# EasyEDA Pro project ProPrj_Piano_scan_for_conserts3_2026-02-26.epro, board all
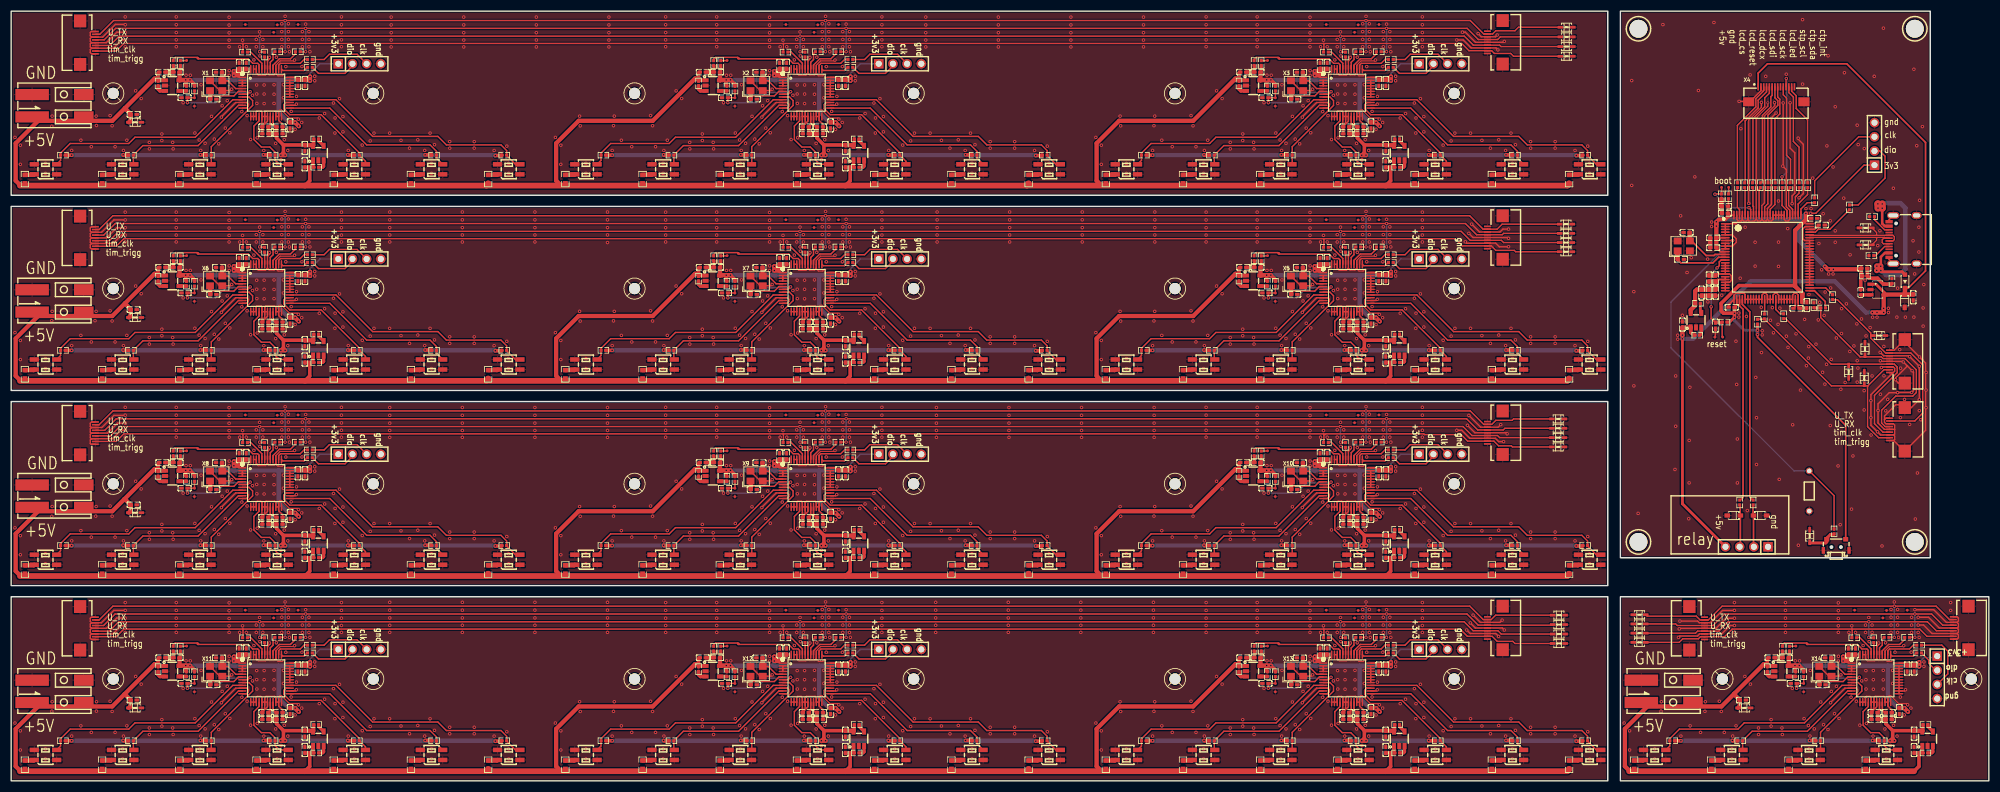
[diagram p6: board, top side]
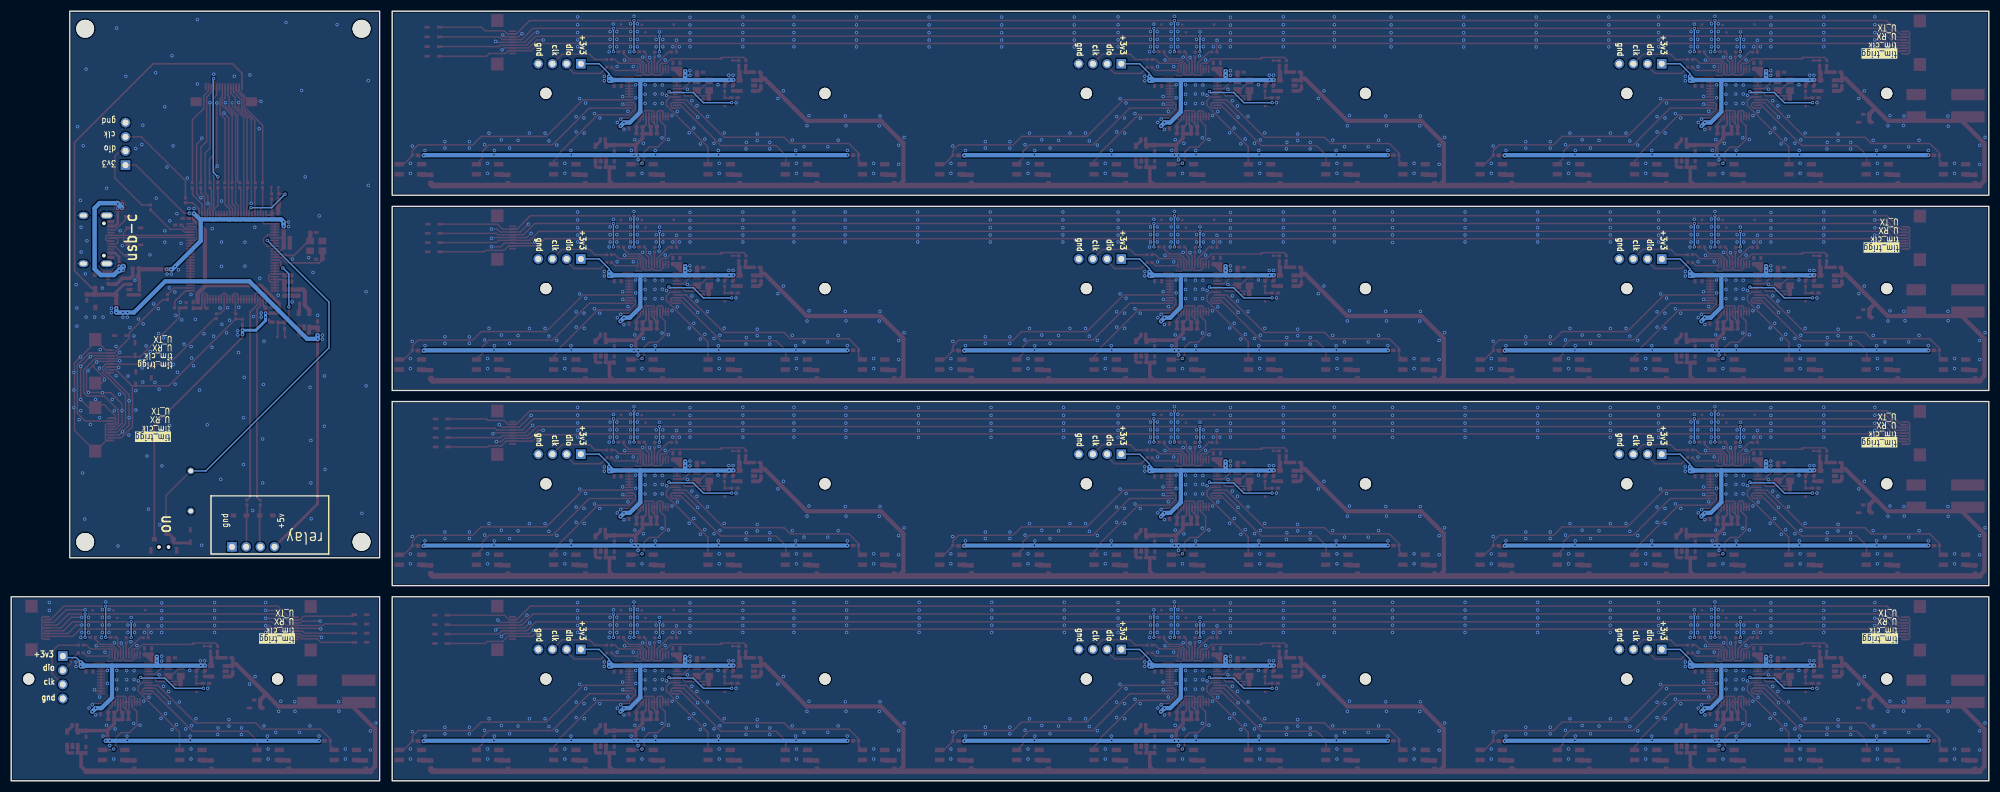
[diagram p7: board, bottom side, seen from below]

Outline 354.25 x 138 mm; copper layers: Top Layer, Bottom Layer. Coordinates in mm from the lower left corner of the outline.
Outline path: rectangle 0,138 286,105 ; rectangle 0,103 286,70 ; rectangle 0,68 286,35 ; rectangle 0,33 286,0 ; rectangle 288.25,33 354.25,0 ; rectangle 343.75,138 288.25,40
Stack: Top Layer 0.035mm / Dielectric1 1.51mm FR4 er 4.5 / Bottom Layer 0.035mm

## Design rules (mm)
net $1N15983: connect
net $1N15973: connect
net $1N15979: connect
net $1N15981: connect
net $1N15995: connect
net $1N15989: connect
net $1N15991: connect
net $1N15993: connect
net $1N16007: connect
net $1N16001: connect
net $1N16003: connect
net $1N16005: connect
net $1N16019: connect
net $1N16013: connect
net $1N16015: connect
net $1N16017: connect
net $1N16029: connect
net $1N16027: connect
net $1N16021: connect
net $1N16031: connect
net $1I21762\TIM_CLK: connect
net $1I21762\U_RX: connect
net $1I21762\TIM_TRIGG: connect
net $1I21762\U_TX: connect
net $1I21762\LCD_CS: connect
net $1I21762\LCD_RESET: connect
net $1I21762\LCD_DCX: connect
net $1I21762\LCD_SDI: connect
net $1I21762\LCD_SCK: connect
net $1I21762\LCD_LED: connect
net $1I21762\CTP_RST: connect
net $1I21762\CTP_SCL: connect
net $1I21762\CTP_SDA: connect
net $1I21762\$1N6680: connect
net $1I21762\CTP_INT: connect
net $1I21762\$1N6676: connect
net $1I21762\$1N6551: connect
net $1I21762\$1N6507: connect
net $1I21762\$1N6457: connect
net $1I21762\$1N6416: connect
net $1I21762\$1N6370: connect
net $1I21762\$1N6331: connect
net $1I21762\$1N6271: connect
net $1I21762\$1N6685: connect
template: Custom Config
spacing copperThickness1oz (default): track to track 0.102, other pairs 0.152 to 0.3
spacing copperThickness2oz: track to track 0.203, other pairs 0.152 to 0.3
track width copperThickness1oz (default): min 0.127, default 0.254, max 2.54
track width copperThickness2oz: min 0.203, default 0.254, max 2.54
track width usb track: min 0.241, default 0.241, max 0.241
differential pair differentialPair (default): width min 0.127, default 0.254, max 2.54; gap min 0.127, default 0.127
via viaSize (default): diameter min 0.5, default 0.61, max 10; hole min 0.3, default 0.305, max 6.3
net $1I21762\USB_DN uses usb track
net $1I21762\USB_DP uses usb track
['net', '$1i21762\\usb dn'] ['NET', 'GND'] uses usb  cooper zone
['net', '$1i21762\\usb dp'] ['NET', 'GND'] uses usb  cooper zone
['net class', 'connect'] ['NET', 'GND'] uses connect zone

## Placement (name value [footprint] x y rotation side)
BOOT1  -  [Test-Point-0.5mm]  31.43 129.17 0 top
BOOT2  -  [Test-Point-0.5mm]  33.45 129.56 0 top
BOOT3  -  [Test-Point-0.5mm]  128.25 129.17 0 top
BOOT4  -  [Test-Point-0.5mm]  130.26 129.56 0 top
BOOT5  -  [Test-Point-0.5mm]  225.06 129.17 0 top
BOOT6  -  [Test-Point-0.5mm]  227.07 129.56 0 top
BOOT7  -  [Test-Point-0.5mm]  225.06 94.17 0 top
BOOT8  -  [Test-Point-0.5mm]  227.07 94.56 0 top
BOOT9  -  [Test-Point-0.5mm]  31.43 94.17 0 top
BOOT10  -  [Test-Point-0.5mm]  33.45 94.56 0 top
BOOT11  -  [Test-Point-0.5mm]  128.25 94.17 0 top
BOOT12  -  [Test-Point-0.5mm]  130.26 94.56 0 top
BOOT13  -  [Test-Point-0.5mm]  31.43 59.17 0 top
BOOT14  -  [Test-Point-0.5mm]  33.45 59.56 0 top
BOOT15  -  [Test-Point-0.5mm]  128.25 59.17 0 top
BOOT16  -  [Test-Point-0.5mm]  130.26 59.56 0 top
BOOT17  -  [Test-Point-0.5mm]  225.06 59.17 0 top
BOOT18  -  [Test-Point-0.5mm]  227.07 59.56 0 top
BOOT19  -  [Test-Point-0.5mm]  31.43 24.16 0 top
BOOT20  -  [Test-Point-0.5mm]  33.45 24.56 0 top
BOOT21  -  [Test-Point-0.5mm]  128.25 24.16 0 top
BOOT22  -  [Test-Point-0.5mm]  130.26 24.56 0 top
BOOT23  -  [Test-Point-0.5mm]  225.06 24.16 0 top
BOOT24  -  [Test-Point-0.5mm]  227.07 24.56 0 top
BOOT25  -  [Test-Point-0.5mm]  319.69 24.16 0 top
BOOT26  -  [Test-Point-0.5mm]  321.71 24.56 0 top
C1  -  [C0402]  36.21 122.23 0 top
C2  -  [C0402]  27.08 127.07 0 top
C3  -  [C0402]  37.23 127.05 0 top
C4  -  [C0402]  40.84 128.19 90 top
C5  -  [C0402]  52.61 110.54 90 top
C6  -  [C0402]  52.61 113.46 270 top
C7  -  [C0402]  31.06 122.48 180 top
C8  -  [C0402]  48.08 116 0 top
C9  -  [C0402]  45.54 117.27 180 top
C10  -  [C0402]  45.54 116 180 top
C11  -  [C0402]  48.08 117.27 0 top
C12  -  [C0402]  49.96 117.52 270 top
C13  -  [C0402]  42.11 128.19 90 top
C14  -  [C0402]  52.63 125.14 270 top
C15  -  [C0402]  51.36 125.14 270 top
C16  -  [C0402]  29.62 127.07 180 top
C17  -  [C0402]  133.02 122.23 0 top
C18  -  [C0402]  123.89 127.07 0 top
C19  -  [C0402]  134.04 127.05 0 top
C20  -  [C0402]  137.65 128.19 90 top
C21  -  [C0402]  149.42 110.54 90 top
C22  -  [C0402]  149.42 113.46 270 top
C23  -  [C0402]  127.87 122.48 180 top
C24  -  [C0402]  144.89 116 0 top
C25  -  [C0402]  142.35 117.27 180 top
C26  -  [C0402]  142.35 116 180 top
C27  -  [C0402]  144.89 117.27 0 top
C28  -  [C0402]  146.77 117.52 270 top
C29  -  [C0402]  138.92 128.19 90 top
C30  -  [C0402]  149.44 125.14 270 top
C31  -  [C0402]  148.17 125.14 270 top
C32  -  [C0402]  126.43 127.07 180 top
C33  -  [C0402]  229.83 122.23 0 top
C34  -  [C0402]  220.7 127.07 0 top
C35  -  [C0402]  230.85 127.05 0 top
C36  -  [C0402]  234.46 128.19 90 top
C37  -  [C0402]  246.23 110.54 90 top
C38  -  [C0402]  246.23 113.46 270 top
C39  -  [C0402]  224.68 122.48 180 top
C40  -  [C0402]  241.7 116 0 top
C41  -  [C0402]  239.16 117.27 180 top
C42  -  [C0402]  239.16 116 180 top
C43  -  [C0402]  241.7 117.27 0 top
C44  -  [C0402]  243.58 117.52 270 top
C45  -  [C0402]  235.73 128.19 90 top
C46  -  [C0402]  246.25 125.14 270 top
C47  -  [C0402]  244.98 125.14 270 top
C48  -  [C0402]  223.24 127.07 180 top
C49  4.7uF  [C0402]  21.95 119.49 180 top
C50  22pF  [C0402]  331.94 91.9 180 top
C51  1uF  [C0402]  299.35 81.81 90 top
C52  1uF  [C0402]  302.78 87.53 270 top
C53  10pF  [C0402]  300.12 98.33 0 top
C54  10pF  [C0402]  299.1 93.5 0 top
C55  100nF  [C0402]  304.89 97.36 0 top
C56  4.7uF  [C0402]  340.71 86.69 90 top
C57  1uF  [C0402]  305.32 87.53 270 top
C58  100nF  [C0402]  304.13 90.07 90 top
C59  1uF  [C0402]  304.13 87.53 270 top
C60  100nF  [C0402]  305.32 90.07 90 top
C61  2.2uF  [C0402]  324.32 99.65 180 top
C62  100nF  [C0402]  305.27 81.61 270 top
C63  2.2uF  [C0402]  319.8 84.74 0 top
C64  100nF  [C0402]  304.89 95.58 180 top
C65  100nF  [C0402]  306.97 101.75 180 top
C66  100nF  [C0402]  308.19 84.91 180 top
C67  100nF  [C0402]  321.66 85.3 270 top
C68  100nF  [C0402]  322.97 100.86 0 top
C69  10uF  [C0402]  306.97 103.02 180 top
C70  -  [C0402]  229.83 87.23 0 top
C71  -  [C0402]  220.7 92.07 0 top
C72  -  [C0402]  230.85 92.05 0 top
C73  -  [C0402]  234.46 93.19 90 top
C74  -  [C0402]  246.23 75.54 90 top
C75  -  [C0402]  246.23 78.46 270 top
C76  -  [C0402]  224.68 87.48 180 top
C77  -  [C0402]  241.7 81 0 top
C78  -  [C0402]  239.16 82.27 180 top
C79  -  [C0402]  239.16 81 180 top
C80  -  [C0402]  241.7 82.27 0 top
C81  -  [C0402]  243.58 82.52 270 top
C82  -  [C0402]  235.73 93.19 90 top
C83  -  [C0402]  246.25 90.14 270 top
C84  -  [C0402]  244.98 90.14 270 top
C85  -  [C0402]  223.24 92.07 180 top
C86  -  [C0402]  36.21 87.23 0 top
C87  -  [C0402]  27.08 92.07 0 top
C88  -  [C0402]  37.23 92.05 0 top
C89  -  [C0402]  40.84 93.19 90 top
C90  -  [C0402]  52.61 75.54 90 top
C91  -  [C0402]  52.61 78.46 270 top
C92  -  [C0402]  31.06 87.48 180 top
C93  -  [C0402]  48.08 81 0 top
C94  -  [C0402]  45.54 82.27 180 top
C95  -  [C0402]  45.54 81 180 top
C96  -  [C0402]  48.08 82.27 0 top
C97  -  [C0402]  49.96 82.52 270 top
C98  -  [C0402]  42.11 93.19 90 top
C99  -  [C0402]  52.63 90.14 270 top
C100  -  [C0402]  51.36 90.14 270 top
C101  -  [C0402]  29.62 92.07 180 top
C102  -  [C0402]  133.02 87.23 0 top
C103  -  [C0402]  123.89 92.07 0 top
C104  -  [C0402]  134.04 92.05 0 top
C105  -  [C0402]  137.65 93.19 90 top
C106  -  [C0402]  149.42 75.54 90 top
C107  -  [C0402]  149.42 78.46 270 top
C108  -  [C0402]  127.87 87.48 180 top
C109  -  [C0402]  144.89 81 0 top
C110  -  [C0402]  142.35 82.27 180 top
C111  -  [C0402]  142.35 81 180 top
C112  -  [C0402]  144.89 82.27 0 top
C113  -  [C0402]  146.77 82.52 270 top
C114  -  [C0402]  138.92 93.19 90 top
C115  -  [C0402]  149.44 90.14 270 top
C116  -  [C0402]  148.17 90.14 270 top
C117  -  [C0402]  126.43 92.07 180 top
C118  4.7uF  [C0402]  21.95 84.49 180 top
C119  -  [C0402]  36.21 52.23 0 top
C120  -  [C0402]  27.08 57.07 0 top
C121  -  [C0402]  37.23 57.05 0 top
C122  -  [C0402]  40.84 58.19 90 top
C123  -  [C0402]  52.61 40.54 90 top
C124  -  [C0402]  52.61 43.46 270 top
C125  -  [C0402]  31.06 52.48 180 top
C126  -  [C0402]  48.08 46 0 top
C127  -  [C0402]  45.54 47.27 180 top
C128  -  [C0402]  45.54 46 180 top
C129  -  [C0402]  48.08 47.27 0 top
C130  -  [C0402]  49.96 47.52 270 top
C131  -  [C0402]  42.11 58.19 90 top
C132  -  [C0402]  52.63 55.14 270 top
C133  -  [C0402]  51.36 55.14 270 top
C134  -  [C0402]  29.62 57.07 180 top
C135  -  [C0402]  133.02 52.23 0 top
C136  -  [C0402]  123.89 57.07 0 top
C137  -  [C0402]  134.04 57.05 0 top
C138  -  [C0402]  137.65 58.19 90 top
C139  -  [C0402]  149.42 40.54 90 top
C140  -  [C0402]  149.42 43.46 270 top
C141  -  [C0402]  127.87 52.48 180 top
C142  -  [C0402]  144.89 46 0 top
C143  -  [C0402]  142.35 47.27 180 top
C144  -  [C0402]  142.35 46 180 top
C145  -  [C0402]  144.89 47.27 0 top
C146  -  [C0402]  146.77 47.52 270 top
C147  -  [C0402]  138.92 58.19 90 top
C148  -  [C0402]  149.44 55.14 270 top
C149  -  [C0402]  148.17 55.14 270 top
C150  -  [C0402]  126.43 57.07 180 top
C151  -  [C0402]  229.83 52.23 0 top
C152  -  [C0402]  220.7 57.07 0 top
C153  -  [C0402]  230.85 57.05 0 top
C154  -  [C0402]  234.46 58.19 90 top
C155  -  [C0402]  246.23 40.54 90 top
C156  -  [C0402]  246.23 43.46 270 top
C157  -  [C0402]  224.68 52.48 180 top
C158  -  [C0402]  241.7 46 0 top
C159  -  [C0402]  239.16 47.27 180 top
C160  -  [C0402]  239.16 46 180 top
C161  -  [C0402]  241.7 47.27 0 top
C162  -  [C0402]  243.58 47.52 270 top
C163  -  [C0402]  235.73 58.19 90 top
C164  -  [C0402]  246.25 55.14 270 top
C165  -  [C0402]  244.98 55.14 270 top
C166  -  [C0402]  223.24 57.07 180 top
C167  4.7uF  [C0402]  21.95 49.49 180 top
C168  -  [C0402]  36.21 17.23 0 top
C169  -  [C0402]  27.08 22.07 0 top
C170  -  [C0402]  37.23 22.05 0 top
C171  -  [C0402]  40.84 23.19 90 top
C172  -  [C0402]  52.61 5.54 90 top
C173  -  [C0402]  52.61 8.46 270 top
C174  -  [C0402]  31.06 17.48 180 top
C175  -  [C0402]  48.08 11 0 top
C176  -  [C0402]  45.54 12.27 180 top
C177  -  [C0402]  45.54 11 180 top
C178  -  [C0402]  48.08 12.27 0 top
C179  -  [C0402]  49.96 12.52 270 top
C180  -  [C0402]  42.11 23.19 90 top
C181  -  [C0402]  52.63 20.14 270 top
C182  -  [C0402]  51.36 20.14 270 top
C183  -  [C0402]  29.62 22.07 180 top
C184  -  [C0402]  133.02 17.23 0 top
C185  -  [C0402]  123.89 22.07 0 top
C186  -  [C0402]  134.04 22.05 0 top
C187  -  [C0402]  137.65 23.19 90 top
C188  -  [C0402]  149.42 5.54 90 top
C189  -  [C0402]  149.42 8.46 270 top
C190  -  [C0402]  127.87 17.48 180 top
C191  -  [C0402]  144.89 11 0 top
C192  -  [C0402]  142.35 12.27 180 top
C193  -  [C0402]  142.35 11 180 top
C194  -  [C0402]  144.89 12.27 0 top
C195  -  [C0402]  146.77 12.52 270 top
C196  -  [C0402]  138.92 23.19 90 top
C197  -  [C0402]  149.44 20.14 270 top
C198  -  [C0402]  148.17 20.14 270 top
C199  -  [C0402]  126.43 22.07 180 top
C200  -  [C0402]  229.83 17.23 0 top
C201  -  [C0402]  220.7 22.07 0 top
C202  -  [C0402]  230.85 22.05 0 top
C203  -  [C0402]  234.46 23.19 90 top
C204  -  [C0402]  246.23 5.54 90 top
C205  -  [C0402]  246.23 8.46 270 top
C206  -  [C0402]  224.68 17.48 180 top
C207  -  [C0402]  241.7 11 0 top
C208  -  [C0402]  239.16 12.27 180 top
C209  -  [C0402]  239.16 11 180 top
C210  -  [C0402]  241.7 12.27 0 top
C211  -  [C0402]  243.58 12.52 270 top
C212  -  [C0402]  235.73 23.19 90 top
C213  -  [C0402]  246.25 20.14 270 top
C214  -  [C0402]  244.98 20.14 270 top
C215  -  [C0402]  223.24 22.07 180 top
C216  4.7uF  [C0402]  21.95 14.49 180 top
C217  -  [C0402]  324.47 17.23 0 top
C218  -  [C0402]  315.34 22.07 0 top
C219  -  [C0402]  325.48 22.05 0 top
C220  -  [C0402]  329.09 23.19 90 top
C221  -  [C0402]  340.86 5.54 90 top
C222  -  [C0402]  340.86 8.46 270 top
C223  -  [C0402]  319.31 17.48 180 top
C224  -  [C0402]  336.33 11 0 top
C225  -  [C0402]  333.79 12.27 180 top
C226  -  [C0402]  333.79 11 180 top
C227  -  [C0402]  336.33 12.27 0 top
C228  -  [C0402]  338.21 12.52 270 top
C229  -  [C0402]  330.36 23.19 90 top
C230  -  [C0402]  340.88 20.14 270 top
C231  -  [C0402]  339.61 20.14 270 top
C232  -  [C0402]  317.88 22.07 180 top
C233  4.7uF  [C0402]  310.2 14.49 180 top
D1  CDSOD323-T05C  [SOD-323_L1.8-W1.3-LS2.5-BI]  22.2 118.08 180 top
D2  CDSOD323-T03C  [SOD-323_L1.8-W1.3-LS2.5-BI]  278.62 135.12 0 top
D3  CDSOD323-T03C  [SOD-323_L1.8-W1.3-LS2.5-BI]  278.62 133.38 0 top
D4  CDSOD323-T03C  [SOD-323_L1.8-W1.3-LS2.5-BI]  278.62 131.65 0 top
D5  CDSOD323-T03C  [SOD-323_L1.8-W1.3-LS2.5-BI]  278.62 129.91 0 top
D6  CDSOD323-T03C  [SOD-323_L1.8-W1.3-LS2.5-BI]  329.15 73.36 270 top
D7  CDSOD323-T03C  [SOD-323_L1.8-W1.3-LS2.5-BI]  332.07 77.42 90 top
D8  CDSOD323-T03C  [SOD-323_L1.8-W1.3-LS2.5-BI]  331.94 72.21 90 top
D9  CDSOD323-T03C  [SOD-323_L1.8-W1.3-LS2.5-BI]  334.61 79.83 0 top
D10  LESD3Z5.0T1G  [SOD-323_L1.8-W1.3-LS2.5-RD]  339.18 86.06 270 top
D11  B5819WS  [SOD-323_L1.7-W1.3-LS2.5-RD]  339.23 89.56 90 top
D12  LESD3Z5.0T1G  [SOD-323_L1.8-W1.3-LS2.5-RD]  313.27 47.58 0 top
D13  LESD3Z5.0T1G  [SOD-323_L1.8-W1.3-LS2.5-RD]  308.57 47.58 180 top
D14  CDSOD323-T05C  [SOD-323_L1.8-W1.3-LS2.5-BI]  332.2 96.09 180 top
D15  CDSOD323-T05C  [SOD-323_L1.8-W1.3-LS2.5-BI]  332.2 99.14 180 top
D16  CDSOD323-T03C  [SOD-323_L1.8-W1.3-LS2.5-BI]  322.16 43.89 270 top
D19  CDSOD323-T05C  [SOD-323_L1.8-W1.3-LS2.5-BI]  22.2 83.08 180 top
D20  CDSOD323-T03C  [SOD-323_L1.8-W1.3-LS2.5-BI]  278.51 99.81 0 top
D21  CDSOD323-T03C  [SOD-323_L1.8-W1.3-LS2.5-BI]  278.51 98.16 0 top
D22  CDSOD323-T03C  [SOD-323_L1.8-W1.3-LS2.5-BI]  278.51 96.51 0 top
D23  CDSOD323-T03C  [SOD-323_L1.8-W1.3-LS2.5-BI]  278.51 94.86 0 top
D24  CDSOD323-T05C  [SOD-323_L1.8-W1.3-LS2.5-BI]  22.2 48.08 180 top
D25  CDSOD323-T03C  [SOD-323_L1.8-W1.3-LS2.5-BI]  277.11 64.89 0 top
D26  CDSOD323-T03C  [SOD-323_L1.8-W1.3-LS2.5-BI]  277.11 63.21 0 top
D27  CDSOD323-T03C  [SOD-323_L1.8-W1.3-LS2.5-BI]  277.11 61.54 0 top
D28  CDSOD323-T03C  [SOD-323_L1.8-W1.3-LS2.5-BI]  277.11 59.87 0 top
D29  CDSOD323-T05C  [SOD-323_L1.8-W1.3-LS2.5-BI]  22.2 13.08 180 top
D30  CDSOD323-T03C  [SOD-323_L1.8-W1.3-LS2.5-BI]  277.24 29.71 0 top
D31  CDSOD323-T03C  [SOD-323_L1.8-W1.3-LS2.5-BI]  277.24 28.02 0 top
D32  CDSOD323-T03C  [SOD-323_L1.8-W1.3-LS2.5-BI]  277.24 26.32 0 top
D33  CDSOD323-T03C  [SOD-323_L1.8-W1.3-LS2.5-BI]  277.24 24.63 0 top
D34  CDSOD323-T05C  [SOD-323_L1.8-W1.3-LS2.5-BI]  310.45 13.08 180 top
D35  CDSOD323-T03C  [SOD-323_L1.8-W1.3-LS2.5-BI]  291.68 29.78 180 top
D36  CDSOD323-T03C  [SOD-323_L1.8-W1.3-LS2.5-BI]  291.68 28.13 180 top
D37  CDSOD323-T03C  [SOD-323_L1.8-W1.3-LS2.5-BI]  291.68 26.48 180 top
D38  CDSOD323-T03C  [SOD-323_L1.8-W1.3-LS2.5-BI]  291.68 24.83 180 top
G1  -  [Test-Point-0.5mm]  41.95 135.6 180 top
G2  -  [Test-Point-0.5mm]  47.02 134.21 180 top
G3  -  [Test-Point-0.5mm]  51.39 135.6 180 top
G4  -  [Test-Point-0.5mm]  47.67 135.55 180 top
G5  -  [Test-Point-0.5mm]  138.76 135.6 180 top
G6  -  [Test-Point-0.5mm]  143.83 134.21 180 top
G7  -  [Test-Point-0.5mm]  148.2 135.6 180 top
G8  -  [Test-Point-0.5mm]  144.48 135.55 180 top
G9  -  [Test-Point-0.5mm]  235.57 135.6 180 top
G10  -  [Test-Point-0.5mm]  240.64 134.21 180 top
G11  -  [Test-Point-0.5mm]  245.01 135.6 180 top
G12  -  [Test-Point-0.5mm]  241.29 135.55 180 top
G13  -  [Test-Point-0.5mm]  235.57 100.6 180 top
G14  -  [Test-Point-0.5mm]  240.64 99.21 180 top
G15  -  [Test-Point-0.5mm]  245.01 100.6 180 top
G16  -  [Test-Point-0.5mm]  241.29 100.55 180 top
G17  -  [Test-Point-0.5mm]  41.95 100.6 180 top
G18  -  [Test-Point-0.5mm]  47.02 99.21 180 top
G19  -  [Test-Point-0.5mm]  51.39 100.6 180 top
G20  -  [Test-Point-0.5mm]  47.67 100.55 180 top
G21  -  [Test-Point-0.5mm]  138.76 100.6 180 top
G22  -  [Test-Point-0.5mm]  143.83 99.21 180 top
G23  -  [Test-Point-0.5mm]  148.2 100.6 180 top
G24  -  [Test-Point-0.5mm]  144.48 100.55 180 top
G25  -  [Test-Point-0.5mm]  41.95 65.6 180 top
G26  -  [Test-Point-0.5mm]  47.02 64.21 180 top
G27  -  [Test-Point-0.5mm]  51.39 65.6 180 top
G28  -  [Test-Point-0.5mm]  47.67 65.55 180 top
G29  -  [Test-Point-0.5mm]  138.76 65.6 180 top
G30  -  [Test-Point-0.5mm]  143.83 64.21 180 top
G31  -  [Test-Point-0.5mm]  148.2 65.6 180 top
G32  -  [Test-Point-0.5mm]  144.48 65.55 180 top
G33  -  [Test-Point-0.5mm]  235.57 65.6 180 top
G34  -  [Test-Point-0.5mm]  240.64 64.21 180 top
G35  -  [Test-Point-0.5mm]  245.01 65.6 180 top
G36  -  [Test-Point-0.5mm]  241.29 65.55 180 top
G37  -  [Test-Point-0.5mm]  41.95 30.6 180 top
G38  -  [Test-Point-0.5mm]  47.02 29.21 180 top
G39  -  [Test-Point-0.5mm]  51.39 30.6 180 top
G40  -  [Test-Point-0.5mm]  47.67 30.55 180 top
G41  -  [Test-Point-0.5mm]  138.76 30.6 180 top
G42  -  [Test-Point-0.5mm]  143.83 29.21 180 top
G43  -  [Test-Point-0.5mm]  148.2 30.6 180 top
G44  -  [Test-Point-0.5mm]  144.48 30.55 180 top
G45  -  [Test-Point-0.5mm]  235.57 30.6 180 top
G46  -  [Test-Point-0.5mm]  240.64 29.21 180 top
G47  -  [Test-Point-0.5mm]  245.01 30.6 180 top
G48  -  [Test-Point-0.5mm]  241.29 30.55 180 top
G49  -  [Test-Point-0.5mm]  330.21 30.6 180 top
G50  -  [Test-Point-0.5mm]  335.27 29.21 180 top
G51  -  [Test-Point-0.5mm]  339.65 30.6 180 top
G52  -  [Test-Point-0.5mm]  335.93 30.55 180 top
H1  d  [HDR-TH_4P-P2.54-V-M]  62.41 128.57 0 top
H2  d  [HDR-TH_4P-P2.54-V-M]  159.22 128.57 0 top
H3  d  [HDR-TH_4P-P2.54-V-M]  256.03 128.57 0 top
H5  debug  [HDR-TH_4P-P2.54-V-M]  333.77 114.2 90 top
H6  relay  [HDR-TH_4P-P2.54-V-M]  310.89 41.96 180 top
H7  d  [HDR-TH_4P-P2.54-V-M]  256.03 93.57 0 top
H8  d  [HDR-TH_4P-P2.54-V-M]  62.41 93.57 0 top
H9  d  [HDR-TH_4P-P2.54-V-M]  159.22 93.57 0 top
H10  d  [HDR-TH_4P-P2.54-V-M]  62.41 58.57 0 top
H11  d  [HDR-TH_4P-P2.54-V-M]  159.22 58.57 0 top
H12  d  [HDR-TH_4P-P2.54-V-M]  256.03 58.57 0 top
H13  d  [HDR-TH_4P-P2.54-V-M]  62.41 23.57 0 top
H14  d  [HDR-TH_4P-P2.54-V-M]  159.22 23.57 0 top
H15  d  [HDR-TH_4P-P2.54-V-M]  256.03 23.57 0 top
H16  d  [HDR-TH_4P-P2.54-V-M]  345.01 18.55 270 top
L1  2.2uH  [IND-SMD_L1.2-W0.7]  331.31 87.58 90 top
R1  -  [R0402]  9.28 112.18 180 top
R2  -  [R0402]  21.46 112.18 0 top
R3  -  [R0402]  35.42 112.18 0 top
R4  -  [R0402]  46.83 112.18 0 top
R5  -  [R0402]  61.93 112.18 0 top
R6  -  [R0402]  75.76 112.18 0 top
R7  -  [R0402]  88.32 112.18 0 top
R8  -  [R0603]  2.46 107.89 90 top
R9  -  [R0603]  16.29 107.89 90 top
R10  -  [R0603]  30.12 107.89 90 top
R11  -  [R0603]  43.95 107.89 90 top
R12  -  [R0603]  57.78 107.89 90 top
R13  -  [R0603]  71.61 107.89 90 top
R14  -  [R0603]  85.44 107.89 90 top
R15  -  [R0402]  26.32 125.04 90 top
R16  -  [R0402]  31.4 124.15 90 top
R17  -  [R0402]  54.65 110.01 180 top
R18  -  [R0402]  54.65 115.09 180 top
R19  62Ω  [R0402]  41.89 130.66 180 top
R20  62Ω  [R0402]  45.39 130.22 90 top
R21  62Ω  [R0402]  47.67 130.73 0 top
R22  62Ω  [R0402]  51.36 130.73 0 top
R23  -  [R0402]  30.3 128.7 90 top
R24  -  [R0402]  32.84 124.13 270 top
R25  -  [R0402]  29.03 128.7 90 top
R27  -  [R0402]  53.52 127.93 0 top
R28  -  [R0402]  53.52 129.33 0 top
R29  -  [R0402]  106.09 112.18 180 top
R30  -  [R0402]  118.27 112.18 0 top
R31  -  [R0402]  132.23 112.18 0 top
R32  -  [R0402]  143.64 112.18 0 top
R33  -  [R0402]  158.74 112.18 0 top
R34  -  [R0402]  172.57 112.18 0 top
R35  -  [R0402]  185.13 112.18 0 top
R36  -  [R0603]  99.27 107.89 90 top
R37  -  [R0603]  113.1 107.89 90 top
R38  -  [R0603]  126.93 107.89 90 top
R39  -  [R0603]  140.76 107.89 90 top
R40  -  [R0603]  154.59 107.89 90 top
R41  -  [R0603]  168.42 107.89 90 top
R42  -  [R0603]  182.25 107.89 90 top
R43  -  [R0402]  123.13 125.04 90 top
R44  -  [R0402]  128.21 124.15 90 top
R45  -  [R0402]  151.46 110.01 180 top
R46  -  [R0402]  151.46 115.09 180 top
R47  62Ω  [R0402]  138.7 130.66 180 top
R48  62Ω  [R0402]  142.2 130.22 90 top
R49  62Ω  [R0402]  144.48 130.73 0 top
R50  62Ω  [R0402]  148.17 130.73 0 top
R51  -  [R0402]  127.11 128.7 90 top
R52  -  [R0402]  129.65 124.13 270 top
R53  -  [R0402]  125.84 128.7 90 top
R55  -  [R0402]  150.33 127.93 0 top
R56  -  [R0402]  150.33 129.33 0 top
R57  -  [R0402]  202.9 112.18 180 top
R58  -  [R0402]  215.08 112.18 0 top
R59  -  [R0402]  229.04 112.18 0 top
R60  -  [R0402]  240.45 112.18 0 top
R61  -  [R0402]  255.55 112.18 0 top
R62  -  [R0402]  269.38 112.18 0 top
R63  -  [R0402]  281.94 112.18 0 top
R64  -  [R0603]  196.08 107.89 90 top
R65  -  [R0603]  209.91 107.89 90 top
R66  -  [R0603]  223.74 107.89 90 top
R67  -  [R0603]  237.57 107.89 90 top
R68  -  [R0603]  251.4 107.89 90 top
R69  -  [R0603]  265.23 107.89 90 top
R70  -  [R0603]  279.06 107.89 90 top
R71  -  [R0402]  219.94 125.04 90 top
R72  -  [R0402]  225.02 124.15 90 top
R73  -  [R0402]  248.27 110.01 180 top
R74  -  [R0402]  248.27 115.09 180 top
R75  62Ω  [R0402]  235.51 130.66 180 top
R76  62Ω  [R0402]  239.01 130.22 90 top
R77  62Ω  [R0402]  241.29 130.73 0 top
R78  62Ω  [R0402]  244.98 130.73 0 top
R79  -  [R0402]  223.92 128.7 90 top
R80  -  [R0402]  226.46 124.13 270 top
R81  -  [R0402]  222.65 128.7 90 top
R83  -  [R0402]  247.14 127.93 0 top
R84  -  [R0402]  247.14 129.33 0 top
R85  680kΩ  [R0402]  332.07 90.5 180 top
R86  150kΩ  [R0402]  336.9 89.61 270 top
R87  10kΩ  [R0402]  302.02 79.91 180 top
R88  100kΩ  [R0402]  302.15 85.62 180 top
R89  62Ω  [R0402]  309.25 106.8 90 top
R90  62Ω  [R0402]  310.51 106.8 90 top
R91  62Ω  [R0402]  311.91 106.8 90 top
R92  62Ω  [R0402]  313.31 106.8 90 top
R93  62Ω  [R0402]  314.71 106.8 90 top
R94  62Ω  [R0402]  315.98 106.8 90 top
R95  33Ω  [R0402]  329.28 102.82 90 top
R96  33Ω  [R0402]  323.05 104.09 90 top
R97  62Ω  [R0402]  317.25 106.8 90 top
R98  62Ω  [R0402]  318.64 106.8 90 top
R99  62Ω  [R0402]  320.29 106.8 90 top
R100  62Ω  [R0402]  321.82 106.8 90 top
R101  330Ω  [R0402]  307.61 104.8 90 top
R102  10kΩ  [R0402]  306.92 82.25 180 top
R103  10kΩ  [R0402]  306.34 104.8 90 top
R104  1kΩ  [R0402]  312.82 82.32 90 top
R105  5.1kΩ  [R0402]  333.21 94.19 0 top
R106  62Ω  [R0402]  314.04 83.26 90 top
R107  62Ω  [R0402]  317.5 83.3 90 top
R108  330Ω  [R0402]  312.04 49.9 90 top
R109  330Ω  [R0402]  309.63 49.9 90 top
R110  62Ω  [R0402]  326.26 86.73 270 top
R111  5.1kΩ  [R0402]  333.34 101.17 0 top
R112  62Ω  [R0402]  324.58 84.79 180 top
R113  1kΩ  [R0402]  322.93 85.3 270 top
R114  330Ω  [R0402]  326.53 44.73 90 top
R115  10kΩ  [RES-TH_BD1.8-L3.2-P7.20-D0.4]  322.09 51.97 90 top
R117  -  [R0402]  202.9 77.18 180 top
R118  -  [R0402]  215.08 77.18 0 top
R119  -  [R0402]  229.04 77.18 0 top
R120  -  [R0402]  240.45 77.18 0 top
R121  -  [R0402]  255.55 77.18 0 top
R122  -  [R0402]  269.38 77.18 0 top
R123  -  [R0402]  281.94 77.18 0 top
R124  -  [R0603]  196.08 72.89 90 top
R125  -  [R0603]  209.91 72.89 90 top
R126  -  [R0603]  223.74 72.89 90 top
R127  -  [R0603]  237.57 72.89 90 top
R128  -  [R0603]  251.4 72.89 90 top
R129  -  [R0603]  265.23 72.89 90 top
R130  -  [R0603]  279.06 72.89 90 top
R131  -  [R0402]  219.94 90.04 90 top
R132  -  [R0402]  225.02 89.15 90 top
R133  -  [R0402]  248.27 75.01 180 top
R134  -  [R0402]  248.27 80.09 180 top
R135  62Ω  [R0402]  235.51 95.66 180 top
R136  62Ω  [R0402]  239.01 95.22 90 top
R137  62Ω  [R0402]  241.29 95.73 0 top
R138  62Ω  [R0402]  244.98 95.73 0 top
R139  -  [R0402]  223.92 93.7 90 top
R140  -  [R0402]  226.46 89.13 270 top
R141  -  [R0402]  222.65 93.7 90 top
R143  -  [R0402]  247.14 92.93 0 top
R144  -  [R0402]  247.14 94.33 0 top
R145  -  [R0402]  9.28 77.18 180 top
R146  -  [R0402]  21.46 77.18 0 top
R147  -  [R0402]  35.42 77.18 0 top
R148  -  [R0402]  46.83 77.18 0 top
R149  -  [R0402]  61.93 77.18 0 top
R150  -  [R0402]  75.76 77.18 0 top
R151  -  [R0402]  88.32 77.18 0 top
R152  -  [R0603]  2.46 72.89 90 top
R153  -  [R0603]  16.29 72.89 90 top
R154  -  [R0603]  30.12 72.89 90 top
R155  -  [R0603]  43.95 72.89 90 top
R156  -  [R0603]  57.78 72.89 90 top
R157  -  [R0603]  71.61 72.89 90 top
R158  -  [R0603]  85.44 72.89 90 top
R159  -  [R0402]  26.32 90.04 90 top
R160  -  [R0402]  31.4 89.15 90 top
R161  -  [R0402]  54.65 75.01 180 top
R162  -  [R0402]  54.65 80.09 180 top
R163  62Ω  [R0402]  41.89 95.66 180 top
R164  62Ω  [R0402]  45.39 95.22 90 top
R165  62Ω  [R0402]  47.67 95.73 0 top
R166  62Ω  [R0402]  51.36 95.73 0 top
R167  -  [R0402]  30.3 93.7 90 top
R168  -  [R0402]  32.84 89.13 270 top
R169  -  [R0402]  29.03 93.7 90 top
R171  -  [R0402]  53.52 92.93 0 top
R172  -  [R0402]  53.52 94.33 0 top
R173  -  [R0402]  106.09 77.18 180 top
R174  -  [R0402]  118.27 77.18 0 top
R175  -  [R0402]  132.23 77.18 0 top
R176  -  [R0402]  143.64 77.18 0 top
R177  -  [R0402]  158.74 77.18 0 top
R178  -  [R0402]  172.57 77.18 0 top
R179  -  [R0402]  185.13 77.18 0 top
R180  -  [R0603]  99.27 72.89 90 top
R181  -  [R0603]  113.1 72.89 90 top
R182  -  [R0603]  126.93 72.89 90 top
R183  -  [R0603]  140.76 72.89 90 top
R184  -  [R0603]  154.59 72.89 90 top
R185  -  [R0603]  168.42 72.89 90 top
R186  -  [R0603]  182.25 72.89 90 top
R187  -  [R0402]  123.13 90.04 90 top
R188  -  [R0402]  128.21 89.15 90 top
R189  -  [R0402]  151.46 75.01 180 top
R190  -  [R0402]  151.46 80.09 180 top
R191  62Ω  [R0402]  138.7 95.66 180 top
R192  62Ω  [R0402]  142.2 95.22 90 top
R193  62Ω  [R0402]  144.48 95.73 0 top
R194  62Ω  [R0402]  148.17 95.73 0 top
R195  -  [R0402]  127.11 93.7 90 top
R196  -  [R0402]  129.65 89.13 270 top
R197  -  [R0402]  125.84 93.7 90 top
R199  -  [R0402]  150.33 92.93 0 top
R200  -  [R0402]  150.33 94.33 0 top
R201  -  [R0402]  9.28 42.18 180 top
R202  -  [R0402]  21.46 42.18 0 top
R203  -  [R0402]  35.42 42.18 0 top
R204  -  [R0402]  46.83 42.18 0 top
R205  -  [R0402]  61.93 42.18 0 top
R206  -  [R0402]  75.76 42.18 0 top
R207  -  [R0402]  88.32 42.18 0 top
R208  -  [R0603]  2.46 37.89 90 top
R209  -  [R0603]  16.29 37.89 90 top
R210  -  [R0603]  30.12 37.89 90 top
R211  -  [R0603]  43.95 37.89 90 top
R212  -  [R0603]  57.78 37.89 90 top
R213  -  [R0603]  71.61 37.89 90 top
R214  -  [R0603]  85.44 37.89 90 top
R215  -  [R0402]  26.32 55.04 90 top
R216  -  [R0402]  31.4 54.15 90 top
R217  -  [R0402]  54.65 40.01 180 top
R218  -  [R0402]  54.65 45.09 180 top
R219  62Ω  [R0402]  41.89 60.66 180 top
R220  62Ω  [R0402]  45.39 60.22 90 top
R221  62Ω  [R0402]  47.67 60.73 0 top
R222  62Ω  [R0402]  51.36 60.73 0 top
R223  -  [R0402]  30.3 58.7 90 top
R224  -  [R0402]  32.84 54.13 270 top
R225  -  [R0402]  29.03 58.7 90 top
R227  -  [R0402]  53.52 57.93 0 top
R228  -  [R0402]  53.52 59.33 0 top
R229  -  [R0402]  106.09 42.18 180 top
R230  -  [R0402]  118.27 42.18 0 top
R231  -  [R0402]  132.23 42.18 0 top
R232  -  [R0402]  143.64 42.18 0 top
R233  -  [R0402]  158.74 42.18 0 top
R234  -  [R0402]  172.57 42.18 0 top
R235  -  [R0402]  185.13 42.18 0 top
R236  -  [R0603]  99.27 37.89 90 top
R237  -  [R0603]  113.1 37.89 90 top
R238  -  [R0603]  126.93 37.89 90 top
R239  -  [R0603]  140.76 37.89 90 top
R240  -  [R0603]  154.59 37.89 90 top
R241  -  [R0603]  168.42 37.89 90 top
R242  -  [R0603]  182.25 37.89 90 top
R243  -  [R0402]  123.13 55.04 90 top
R244  -  [R0402]  128.21 54.15 90 top
R245  -  [R0402]  151.46 40.01 180 top
R246  -  [R0402]  151.46 45.09 180 top
R247  62Ω  [R0402]  138.7 60.66 180 top
R248  62Ω  [R0402]  142.2 60.22 90 top
R249  62Ω  [R0402]  144.48 60.73 0 top
R250  62Ω  [R0402]  148.17 60.73 0 top
R251  -  [R0402]  127.11 58.7 90 top
R252  -  [R0402]  129.65 54.13 270 top
R253  -  [R0402]  125.84 58.7 90 top
R255  -  [R0402]  150.33 57.93 0 top
R256  -  [R0402]  150.33 59.33 0 top
R257  -  [R0402]  202.9 42.18 180 top
R258  -  [R0402]  215.08 42.18 0 top
R259  -  [R0402]  229.04 42.18 0 top
R260  -  [R0402]  240.45 42.18 0 top
R261  -  [R0402]  255.55 42.18 0 top
R262  -  [R0402]  269.38 42.18 0 top
R263  -  [R0402]  281.94 42.18 0 top
R264  -  [R0603]  196.08 37.89 90 top
R265  -  [R0603]  209.91 37.89 90 top
R266  -  [R0603]  223.74 37.89 90 top
R267  -  [R0603]  237.57 37.89 90 top
R268  -  [R0603]  251.4 37.89 90 top
R269  -  [R0603]  265.23 37.89 90 top
R270  -  [R0603]  279.06 37.89 90 top
R271  -  [R0402]  219.94 55.04 90 top
R272  -  [R0402]  225.02 54.15 90 top
R273  -  [R0402]  248.27 40.01 180 top
R274  -  [R0402]  248.27 45.09 180 top
R275  62Ω  [R0402]  235.51 60.66 180 top
R276  62Ω  [R0402]  239.01 60.22 90 top
R277  62Ω  [R0402]  241.29 60.73 0 top
R278  62Ω  [R0402]  244.98 60.73 0 top
R279  -  [R0402]  223.92 58.7 90 top
R280  -  [R0402]  226.46 54.13 270 top
R281  -  [R0402]  222.65 58.7 90 top
R283  -  [R0402]  247.14 57.93 0 top
R284  -  [R0402]  247.14 59.33 0 top
R285  -  [R0402]  9.28 7.18 180 top
R286  -  [R0402]  21.46 7.18 0 top
R287  -  [R0402]  35.42 7.18 0 top
R288  -  [R0402]  46.83 7.18 0 top
R289  -  [R0402]  61.93 7.18 0 top
R290  -  [R0402]  75.76 7.18 0 top
R291  -  [R0402]  88.32 7.18 0 top
R292  -  [R0603]  2.46 2.89 90 top
R293  -  [R0603]  16.29 2.89 90 top
R294  -  [R0603]  30.12 2.89 90 top
R295  -  [R0603]  43.95 2.89 90 top
R296  -  [R0603]  57.78 2.89 90 top
R297  -  [R0603]  71.61 2.89 90 top
R298  -  [R0603]  85.44 2.89 90 top
R299  -  [R0402]  26.32 20.04 90 top
R300  -  [R0402]  31.4 19.15 90 top
R301  -  [R0402]  54.65 5.01 180 top
R302  -  [R0402]  54.65 10.09 180 top
R303  62Ω  [R0402]  41.89 25.66 180 top
R304  62Ω  [R0402]  45.39 25.22 90 top
R305  62Ω  [R0402]  47.67 25.73 0 top
R306  62Ω  [R0402]  51.36 25.73 0 top
R307  -  [R0402]  30.3 23.7 90 top
R308  -  [R0402]  32.84 19.13 270 top
R309  -  [R0402]  29.03 23.7 90 top
R311  -  [R0402]  53.52 22.93 0 top
R312  -  [R0402]  53.52 24.33 0 top
R313  -  [R0402]  106.09 7.18 180 top
R314  -  [R0402]  118.27 7.18 0 top
R315  -  [R0402]  132.23 7.18 0 top
R316  -  [R0402]  143.64 7.18 0 top
R317  -  [R0402]  158.74 7.18 0 top
R318  -  [R0402]  172.57 7.18 0 top
R319  -  [R0402]  185.13 7.18 0 top
R320  -  [R0603]  99.27 2.89 90 top
R321  -  [R0603]  113.1 2.89 90 top
R322  -  [R0603]  126.93 2.89 90 top
R323  -  [R0603]  140.76 2.89 90 top
R324  -  [R0603]  154.59 2.89 90 top
R325  -  [R0603]  168.42 2.89 90 top
R326  -  [R0603]  182.25 2.89 90 top
R327  -  [R0402]  123.13 20.04 90 top
R328  -  [R0402]  128.21 19.15 90 top
R329  -  [R0402]  151.46 5.01 180 top
R330  -  [R0402]  151.46 10.09 180 top
R331  62Ω  [R0402]  138.7 25.66 180 top
R332  62Ω  [R0402]  142.2 25.22 90 top
R333  62Ω  [R0402]  144.48 25.73 0 top
R334  62Ω  [R0402]  148.17 25.73 0 top
R335  -  [R0402]  127.11 23.7 90 top
R336  -  [R0402]  129.65 19.13 270 top
R337  -  [R0402]  125.84 23.7 90 top
R339  -  [R0402]  150.33 22.93 0 top
R340  -  [R0402]  150.33 24.33 0 top
R341  -  [R0402]  202.9 7.18 180 top
R342  -  [R0402]  215.08 7.18 0 top
R343  -  [R0402]  229.04 7.18 0 top
R344  -  [R0402]  240.45 7.18 0 top
R345  -  [R0402]  255.55 7.18 0 top
R346  -  [R0402]  269.38 7.18 0 top
R347  -  [R0402]  281.94 7.18 0 top
R348  -  [R0603]  196.08 2.89 90 top
R349  -  [R0603]  209.91 2.89 90 top
R350  -  [R0603]  223.74 2.89 90 top
R351  -  [R0603]  237.57 2.89 90 top
R352  -  [R0603]  251.4 2.89 90 top
R353  -  [R0603]  265.23 2.89 90 top
R354  -  [R0603]  279.06 2.89 90 top
R355  -  [R0402]  219.94 20.04 90 top
R356  -  [R0402]  225.02 19.15 90 top
R357  -  [R0402]  248.27 5.01 180 top
R358  -  [R0402]  248.27 10.09 180 top
R359  62Ω  [R0402]  235.51 25.66 180 top
R360  62Ω  [R0402]  239.01 25.22 90 top
R361  62Ω  [R0402]  241.29 25.73 0 top
R362  62Ω  [R0402]  244.98 25.73 0 top
R363  -  [R0402]  223.92 23.7 90 top
R364  -  [R0402]  226.46 19.13 270 top
R365  -  [R0402]  222.65 23.7 90 top
R367  -  [R0402]  247.14 22.93 0 top
R368  -  [R0402]  247.14 24.33 0 top
R369  -  [R0402]  297.53 7.18 180 top
R370  -  [R0402]  309.71 7.18 0 top
R371  -  [R0402]  323.67 7.18 0 top
R372  -  [R0402]  335.09 7.18 0 top
R376  -  [R0603]  290.72 2.89 90 top
R377  -  [R0603]  304.55 2.89 90 top
R378  -  [R0603]  318.38 2.89 90 top
R379  -  [R0603]  332.21 2.89 90 top
R383  -  [R0402]  314.57 20.04 90 top
R384  -  [R0402]  319.65 19.15 90 top
R385  -  [R0402]  342.9 5.01 180 top
R386  -  [R0402]  342.9 10.09 180 top
R387  62Ω  [R0402]  330.14 25.66 180 top
R388  62Ω  [R0402]  333.64 25.22 90 top
R389  62Ω  [R0402]  335.93 25.73 0 top
R390  62Ω  [R0402]  339.61 25.73 0 top
R391  -  [R0402]  318.55 23.7 90 top
R392  -  [R0402]  321.09 19.13 270 top
R393  -  [R0402]  317.28 23.7 90 top
R395  -  [R0402]  341.77 22.93 0 top
R396  -  [R0402]  341.77 24.33 0 top
RESET1  -  [Test-Point-0.5mm]  32.83 120.97 0 top
RESET2  -  [Test-Point-0.5mm]  129.64 120.97 0 top
RESET3  -  [Test-Point-0.5mm]  226.45 120.97 0 top
RESET4  -  [Test-Point-0.5mm]  226.45 85.97 0 top
RESET5  -  [Test-Point-0.5mm]  32.83 85.97 0 top
RESET6  -  [Test-Point-0.5mm]  129.64 85.97 0 top
RESET7  -  [Test-Point-0.5mm]  32.83 50.97 0 top
RESET8  -  [Test-Point-0.5mm]  129.64 50.97 0 top
RESET9  -  [Test-Point-0.5mm]  226.45 50.97 0 top
RESET10  -  [Test-Point-0.5mm]  32.83 15.97 0 top
RESET11  -  [Test-Point-0.5mm]  129.64 15.97 0 top
RESET12  -  [Test-Point-0.5mm]  226.45 15.97 0 top
RESET13  -  [Test-Point-0.5mm]  321.08 15.97 0 top
RESSET1  -  [Test-Point-0.5mm]  32.84 122.45 0 top
RESSET2  -  [Test-Point-0.5mm]  129.65 122.45 0 top
RESSET3  -  [Test-Point-0.5mm]  226.46 122.45 0 top
RESSET4  -  [Test-Point-0.5mm]  226.46 87.45 0 top
RESSET5  -  [Test-Point-0.5mm]  32.84 87.45 0 top
RESSET6  -  [Test-Point-0.5mm]  129.65 87.45 0 top
RESSET7  -  [Test-Point-0.5mm]  32.84 52.45 0 top
RESSET8  -  [Test-Point-0.5mm]  129.65 52.45 0 top
RESSET9  -  [Test-Point-0.5mm]  226.46 52.45 0 top
RESSET10  -  [Test-Point-0.5mm]  32.84 17.45 0 top
RESSET11  -  [Test-Point-0.5mm]  129.65 17.45 0 top
RESSET12  -  [Test-Point-0.5mm]  226.46 17.45 0 top
RESSET13  -  [Test-Point-0.5mm]  321.09 17.45 0 top
SCREW1  -  [Screw-Hole-M2]  64.85 123.26 0 top
SCREW2  -  [Screw-Hole-M2]  18.28 123.26 0 top
SCREW3  -  [Screw-Hole-M2]  161.66 123.26 0 top
SCREW4  -  [Screw-Hole-M2]  111.66 123.26 0 top
SCREW5  -  [Screw-Hole-M2]  258.47 123.26 0 top
SCREW6  -  [Screw-Hole-M2]  208.47 123.26 0 top
SCREW7  -  [Screw-Hole-M3]  340.93 42.78 270 top
SCREW8  -  [Screw-Hole-M3]  291.43 134.78 270 top
SCREW9  -  [Screw-Hole-M3]  291.43 42.78 270 top
SCREW10  -  [Screw-Hole-M3]  340.93 134.78 270 top
SCREW11  -  [Screw-Hole-M2]  258.47 88.26 0 top
SCREW12  -  [Screw-Hole-M2]  208.47 88.26 0 top
SCREW13  -  [Screw-Hole-M2]  64.85 88.26 0 top
SCREW14  -  [Screw-Hole-M2]  18.28 88.26 0 top
SCREW15  -  [Screw-Hole-M2]  161.66 88.26 0 top
SCREW16  -  [Screw-Hole-M2]  111.66 88.26 0 top
SCREW17  -  [Screw-Hole-M2]  64.85 53.26 0 top
SCREW18  -  [Screw-Hole-M2]  18.28 53.26 0 top
SCREW19  -  [Screw-Hole-M2]  161.66 53.26 0 top
SCREW20  -  [Screw-Hole-M2]  111.66 53.26 0 top
SCREW21  -  [Screw-Hole-M2]  258.47 53.26 0 top
SCREW22  -  [Screw-Hole-M2]  208.47 53.26 0 top
SCREW23  -  [Screw-Hole-M2]  64.85 18.26 0 top
SCREW24  -  [Screw-Hole-M2]  18.28 18.26 0 top
SCREW25  -  [Screw-Hole-M2]  161.66 18.26 0 top
SCREW26  -  [Screw-Hole-M2]  111.66 18.26 0 top
SCREW27  -  [Screw-Hole-M2]  258.47 18.26 0 top
SCREW28  -  [Screw-Hole-M2]  208.47 18.26 0 top
SCREW29  -  [Screw-Hole-M2]  351.11 18.26 0 top
SCREW30  -  [Screw-Hole-M2]  306.54 18.26 0 top
SW1  1TS003BBB-2000-3503B-CT  [KEY-SMD_1TS003B]  326.91 42.32 0 top
TP1  -  [Test-Point-0.5mm]  307.65 106.41 90 top
TP2  -  [Test-Point-0.5mm]  306.58 79.56 0 top
TP3  -  [Test-Point-0.5mm]  306.38 106.41 90 top
TP4  -  [Test-Point-0.5mm]  305.19 79.56 0 top
U1  q  [OPTO-SMD_QRE1113GR]  6.15 109.64 0 top
U2  q  [OPTO-SMD_QRE1113GR]  19.98 109.64 0 top
U3  q  [OPTO-SMD_QRE1113GR]  33.81 109.64 0 top
U4  q  [OPTO-SMD_QRE1113GR]  47.64 109.64 0 top
U5  q  [OPTO-SMD_QRE1113GR]  61.47 109.64 0 top
U6  q  [OPTO-SMD_QRE1113GR]  75.3 109.64 0 top
U7  q  [OPTO-SMD_QRE1113GR]  89.13 109.64 0 top
U8  p1  [TSOT-23-5_L2.9-W1.6-P0.95-LS2.8-BR]  28.86 124.66 180 top
U9  p2  [TSOT-23-5_L2.9-W1.6-P0.95-LS2.8-BR]  55.03 112.55 270 top
U10  STM32G474CBT6  [LQFP-48_L7.0-W7.0-P0.50-LS9.0-BL]  45.66 123.37 270 top
U11  q  [OPTO-SMD_QRE1113GR]  102.96 109.64 0 top
U12  q  [OPTO-SMD_QRE1113GR]  116.79 109.64 0 top
U13  q  [OPTO-SMD_QRE1113GR]  130.62 109.64 0 top
U14  q  [OPTO-SMD_QRE1113GR]  144.45 109.64 0 top
U15  q  [OPTO-SMD_QRE1113GR]  158.28 109.64 0 top
U16  q  [OPTO-SMD_QRE1113GR]  172.11 109.64 0 top
U17  q  [OPTO-SMD_QRE1113GR]  185.94 109.64 0 top
U18  p1  [TSOT-23-5_L2.9-W1.6-P0.95-LS2.8-BR]  125.67 124.66 180 top
U19  p2  [TSOT-23-5_L2.9-W1.6-P0.95-LS2.8-BR]  151.84 112.55 270 top
U20  STM32G474CBT6  [LQFP-48_L7.0-W7.0-P0.50-LS9.0-BL]  142.47 123.37 270 top
U21  q  [OPTO-SMD_QRE1113GR]  199.77 109.64 0 top
U22  q  [OPTO-SMD_QRE1113GR]  213.6 109.64 0 top
U23  q  [OPTO-SMD_QRE1113GR]  227.43 109.64 0 top
U24  q  [OPTO-SMD_QRE1113GR]  241.26 109.64 0 top
U25  q  [OPTO-SMD_QRE1113GR]  255.09 109.64 0 top
U26  q  [OPTO-SMD_QRE1113GR]  268.92 109.64 0 top
U27  q  [OPTO-SMD_QRE1113GR]  282.75 109.64 0 top
U28  p1  [TSOT-23-5_L2.9-W1.6-P0.95-LS2.8-BR]  222.48 124.66 180 top
U29  p2  [TSOT-23-5_L2.9-W1.6-P0.95-LS2.8-BR]  248.65 112.55 270 top
U30  STM32G474CBT6  [LQFP-48_L7.0-W7.0-P0.50-LS9.0-BL]  239.28 123.37 270 top
U31  AFD01-S09FCA-00  [FPC-SMD_9P-P0.50_JS_AFD01-S09FCA-00]  13.72 132.35 90 top
U32  AFD01-S09FCA-00  [FPC-SMD_9P-P0.50_JS_AFD01-S09FCA-00]  265.81 132.41 270 top
U33  2060-452/998-404  [CONN-SMD_2060-452]  8.38 121.05 0 top
U35  AFD01-S09FCA-00  [FPC-SMD_9P-P0.50_JS_AFD01-S09FCA-00]  337.84 75.21 270 top
U36  AFD01-S09FCA-00  [FPC-SMD_9P-P0.50_JS_AFD01-S09FCA-00]  337.84 63.02 270 top
U37  SY8088AAC  [SOT-23-5_L3.0-W1.7-P0.95-LS2.8-BR]  334.36 88.09 180 top
U38  LDLN030G33R  [TSOT-23-5_L2.9-W1.6-P0.95-LS2.8-BR]  301.8 82.59 270 top
U39  STM32H723VGT6  [LQFP-100_L14.0-W14.0-P0.50-LS16.0-BL]  314.59 93.88 270 top
U40  25MHz  [CRYSTAL-SMD_4P-L3.2-W2.5-BL-1]  299.61 95.91 0 top
U42  q  [OPTO-SMD_QRE1113GR]  199.77 74.64 0 top
U43  q  [OPTO-SMD_QRE1113GR]  213.6 74.64 0 top
U44  q  [OPTO-SMD_QRE1113GR]  227.43 74.64 0 top
U45  q  [OPTO-SMD_QRE1113GR]  241.26 74.64 0 top
U46  q  [OPTO-SMD_QRE1113GR]  255.09 74.64 0 top
U47  q  [OPTO-SMD_QRE1113GR]  268.92 74.64 0 top
U48  q  [OPTO-SMD_QRE1113GR]  282.75 74.64 0 top
U49  p1  [TSOT-23-5_L2.9-W1.6-P0.95-LS2.8-BR]  222.48 89.66 180 top
U50  p2  [TSOT-23-5_L2.9-W1.6-P0.95-LS2.8-BR]  248.65 77.55 270 top
U51  STM32G474CBT6  [LQFP-48_L7.0-W7.0-P0.50-LS9.0-BL]  239.28 88.37 270 top
U52  q  [OPTO-SMD_QRE1113GR]  6.15 74.64 0 top
U53  q  [OPTO-SMD_QRE1113GR]  19.98 74.64 0 top
U54  q  [OPTO-SMD_QRE1113GR]  33.81 74.64 0 top
U55  q  [OPTO-SMD_QRE1113GR]  47.64 74.64 0 top
U56  q  [OPTO-SMD_QRE1113GR]  61.47 74.64 0 top
U57  q  [OPTO-SMD_QRE1113GR]  75.3 74.64 0 top
U58  q  [OPTO-SMD_QRE1113GR]  89.13 74.64 0 top
U59  p1  [TSOT-23-5_L2.9-W1.6-P0.95-LS2.8-BR]  28.86 89.66 180 top
U60  p2  [TSOT-23-5_L2.9-W1.6-P0.95-LS2.8-BR]  55.03 77.55 270 top
U61  STM32G474CBT6  [LQFP-48_L7.0-W7.0-P0.50-LS9.0-BL]  45.66 88.37 270 top
U62  q  [OPTO-SMD_QRE1113GR]  102.96 74.64 0 top
U63  q  [OPTO-SMD_QRE1113GR]  116.79 74.64 0 top
U64  q  [OPTO-SMD_QRE1113GR]  130.62 74.64 0 top
U65  q  [OPTO-SMD_QRE1113GR]  144.45 74.64 0 top
U66  q  [OPTO-SMD_QRE1113GR]  158.28 74.64 0 top
U67  q  [OPTO-SMD_QRE1113GR]  172.11 74.64 0 top
U68  q  [OPTO-SMD_QRE1113GR]  185.94 74.64 0 top
U69  p1  [TSOT-23-5_L2.9-W1.6-P0.95-LS2.8-BR]  125.67 89.66 180 top
U70  p2  [TSOT-23-5_L2.9-W1.6-P0.95-LS2.8-BR]  151.84 77.55 270 top
U71  STM32G474CBT6  [LQFP-48_L7.0-W7.0-P0.50-LS9.0-BL]  142.47 88.37 270 top
U72  AFD01-S09FCA-00  [FPC-SMD_9P-P0.50_JS_AFD01-S09FCA-00]  13.72 97.35 90 top
U73  AFD01-S09FCA-00  [FPC-SMD_9P-P0.50_JS_AFD01-S09FCA-00]  265.81 97.41 270 top
U74  2060-452/998-404  [CONN-SMD_2060-452]  8.38 86.05 0 top
U76  q  [OPTO-SMD_QRE1113GR]  6.15 39.64 0 top
U77  q  [OPTO-SMD_QRE1113GR]  19.98 39.64 0 top
U78  q  [OPTO-SMD_QRE1113GR]  33.81 39.64 0 top
U79  q  [OPTO-SMD_QRE1113GR]  47.64 39.64 0 top
U80  q  [OPTO-SMD_QRE1113GR]  61.47 39.64 0 top
U81  q  [OPTO-SMD_QRE1113GR]  75.3 39.64 0 top
U82  q  [OPTO-SMD_QRE1113GR]  89.13 39.64 0 top
U83  p1  [TSOT-23-5_L2.9-W1.6-P0.95-LS2.8-BR]  28.86 54.66 180 top
U84  p2  [TSOT-23-5_L2.9-W1.6-P0.95-LS2.8-BR]  55.03 42.55 270 top
U85  STM32G474CBT6  [LQFP-48_L7.0-W7.0-P0.50-LS9.0-BL]  45.66 53.37 270 top
U86  q  [OPTO-SMD_QRE1113GR]  102.96 39.64 0 top
U87  q  [OPTO-SMD_QRE1113GR]  116.79 39.64 0 top
U88  q  [OPTO-SMD_QRE1113GR]  130.62 39.64 0 top
U89  q  [OPTO-SMD_QRE1113GR]  144.45 39.64 0 top
U90  q  [OPTO-SMD_QRE1113GR]  158.28 39.64 0 top
U91  q  [OPTO-SMD_QRE1113GR]  172.11 39.64 0 top
U92  q  [OPTO-SMD_QRE1113GR]  185.94 39.64 0 top
U93  p1  [TSOT-23-5_L2.9-W1.6-P0.95-LS2.8-BR]  125.67 54.66 180 top
U94  p2  [TSOT-23-5_L2.9-W1.6-P0.95-LS2.8-BR]  151.84 42.55 270 top
U95  STM32G474CBT6  [LQFP-48_L7.0-W7.0-P0.50-LS9.0-BL]  142.47 53.37 270 top
U96  q  [OPTO-SMD_QRE1113GR]  199.77 39.64 0 top
U97  q  [OPTO-SMD_QRE1113GR]  213.6 39.64 0 top
U98  q  [OPTO-SMD_QRE1113GR]  227.43 39.64 0 top
U99  q  [OPTO-SMD_QRE1113GR]  241.26 39.64 0 top
U100  q  [OPTO-SMD_QRE1113GR]  255.09 39.64 0 top
U101  q  [OPTO-SMD_QRE1113GR]  268.92 39.64 0 top
U102  q  [OPTO-SMD_QRE1113GR]  282.75 39.64 0 top
U103  p1  [TSOT-23-5_L2.9-W1.6-P0.95-LS2.8-BR]  222.48 54.66 180 top
U104  p2  [TSOT-23-5_L2.9-W1.6-P0.95-LS2.8-BR]  248.65 42.55 270 top
U105  STM32G474CBT6  [LQFP-48_L7.0-W7.0-P0.50-LS9.0-BL]  239.28 53.37 270 top
U106  AFD01-S09FCA-00  [FPC-SMD_9P-P0.50_JS_AFD01-S09FCA-00]  13.72 62.35 90 top
U107  AFD01-S09FCA-00  [FPC-SMD_9P-P0.50_JS_AFD01-S09FCA-00]  265.81 62.41 270 top
U108  2060-452/998-404  [CONN-SMD_2060-452]  8.38 51.05 0 top
U110  q  [OPTO-SMD_QRE1113GR]  6.15 4.64 0 top
U111  q  [OPTO-SMD_QRE1113GR]  19.98 4.64 0 top
U112  q  [OPTO-SMD_QRE1113GR]  33.81 4.64 0 top
U113  q  [OPTO-SMD_QRE1113GR]  47.64 4.64 0 top
U114  q  [OPTO-SMD_QRE1113GR]  61.47 4.64 0 top
U115  q  [OPTO-SMD_QRE1113GR]  75.3 4.64 0 top
U116  q  [OPTO-SMD_QRE1113GR]  89.13 4.64 0 top
U117  p1  [TSOT-23-5_L2.9-W1.6-P0.95-LS2.8-BR]  28.86 19.66 180 top
U118  p2  [TSOT-23-5_L2.9-W1.6-P0.95-LS2.8-BR]  55.03 7.55 270 top
U119  STM32G474CBT6  [LQFP-48_L7.0-W7.0-P0.50-LS9.0-BL]  45.66 18.37 270 top
U120  q  [OPTO-SMD_QRE1113GR]  102.96 4.64 0 top
U121  q  [OPTO-SMD_QRE1113GR]  116.79 4.64 0 top
U122  q  [OPTO-SMD_QRE1113GR]  130.62 4.64 0 top
U123  q  [OPTO-SMD_QRE1113GR]  144.45 4.64 0 top
U124  q  [OPTO-SMD_QRE1113GR]  158.28 4.64 0 top
U125  q  [OPTO-SMD_QRE1113GR]  172.11 4.64 0 top
U126  q  [OPTO-SMD_QRE1113GR]  185.94 4.64 0 top
U127  p1  [TSOT-23-5_L2.9-W1.6-P0.95-LS2.8-BR]  125.67 19.66 180 top
U128  p2  [TSOT-23-5_L2.9-W1.6-P0.95-LS2.8-BR]  151.84 7.55 270 top
U129  STM32G474CBT6  [LQFP-48_L7.0-W7.0-P0.50-LS9.0-BL]  142.47 18.37 270 top
U130  q  [OPTO-SMD_QRE1113GR]  199.77 4.64 0 top
U131  q  [OPTO-SMD_QRE1113GR]  213.6 4.64 0 top
U132  q  [OPTO-SMD_QRE1113GR]  227.43 4.64 0 top
U133  q  [OPTO-SMD_QRE1113GR]  241.26 4.64 0 top
U134  q  [OPTO-SMD_QRE1113GR]  255.09 4.64 0 top
U135  q  [OPTO-SMD_QRE1113GR]  268.92 4.64 0 top
U136  q  [OPTO-SMD_QRE1113GR]  282.75 4.64 0 top
U137  p1  [TSOT-23-5_L2.9-W1.6-P0.95-LS2.8-BR]  222.48 19.66 180 top
U138  p2  [TSOT-23-5_L2.9-W1.6-P0.95-LS2.8-BR]  248.65 7.55 270 top
U139  STM32G474CBT6  [LQFP-48_L7.0-W7.0-P0.50-LS9.0-BL]  239.28 18.37 270 top
U140  AFD01-S09FCA-00  [FPC-SMD_9P-P0.50_JS_AFD01-S09FCA-00]  13.72 27.35 90 top
U141  AFD01-S09FCA-00  [FPC-SMD_9P-P0.50_JS_AFD01-S09FCA-00]  265.81 27.41 270 top
U142  2060-452/998-404  [CONN-SMD_2060-452]  8.38 16.05 0 top
U144  q  [OPTO-SMD_QRE1113GR]  294.4 4.64 0 top
U145  q  [OPTO-SMD_QRE1113GR]  308.23 4.64 0 top
U146  q  [OPTO-SMD_QRE1113GR]  322.06 4.64 0 top
U147  q  [OPTO-SMD_QRE1113GR]  335.89 4.64 0 top
U151  p1  [TSOT-23-5_L2.9-W1.6-P0.95-LS2.8-BR]  317.11 19.66 180 top
U152  p2  [TSOT-23-5_L2.9-W1.6-P0.95-LS2.8-BR]  343.28 7.55 270 top
U153  STM32G474CBT6  [LQFP-48_L7.0-W7.0-P0.50-LS9.0-BL]  333.92 18.37 270 top
U154  AFD01-S09FCA-00  [FPC-SMD_9P-P0.50_JS_AFD01-S09FCA-00]  301.97 27.35 90 top
U155  AFD01-S09FCA-00  [FPC-SMD_9P-P0.50_JS_AFD01-S09FCA-00]  349.25 27.41 270 top
U156  2060-452/998-404  [CONN-SMD_2060-452]  296.64 16.05 0 top
USB1  U262-161N-4BVC11  [USB-3.1-SMD_U262-161N-4BVC11]  338.85 97.06 90 top
X1  -  [CRYSTAL-SMD_4P-L3.2-W2.5-BL-1]  36.72 124.64 0 top
X2  -  [CRYSTAL-SMD_4P-L3.2-W2.5-BL-1]  133.53 124.64 0 top
X3  -  [CRYSTAL-SMD_4P-L3.2-W2.5-BL-1]  230.34 124.64 0 top
X4  AFC01-S14FCA-00  [FPC-SMD_AFC01-S14FCA-00]  316.18 123.09 0 top
X5  -  [CRYSTAL-SMD_4P-L3.2-W2.5-BL-1]  230.34 89.64 0 top
X6  -  [CRYSTAL-SMD_4P-L3.2-W2.5-BL-1]  36.72 89.64 0 top
X7  -  [CRYSTAL-SMD_4P-L3.2-W2.5-BL-1]  133.53 89.64 0 top
X8  -  [CRYSTAL-SMD_4P-L3.2-W2.5-BL-1]  36.72 54.64 0 top
X9  -  [CRYSTAL-SMD_4P-L3.2-W2.5-BL-1]  133.53 54.64 0 top
X10  -  [CRYSTAL-SMD_4P-L3.2-W2.5-BL-1]  230.34 54.64 0 top
X11  -  [CRYSTAL-SMD_4P-L3.2-W2.5-BL-1]  36.72 19.64 0 top
X12  -  [CRYSTAL-SMD_4P-L3.2-W2.5-BL-1]  133.53 19.64 0 top
X13  -  [CRYSTAL-SMD_4P-L3.2-W2.5-BL-1]  230.34 19.64 0 top
X14  -  [CRYSTAL-SMD_4P-L3.2-W2.5-BL-1]  324.98 19.64 0 top

## Footprints (pads in the part's own frame, mm; a bottom-side part is the same pattern mirrored in y, then rotated)
C0402
  rect 0.79x0.54 smd: 1(-0.545,0) 2(0.545,0)
CONN-SMD_2060-452
  rect 6x2 smd: 1(-4.625,2) 2(-4.625,-2)
  rect 3.5x2 smd: 1(4.625,2) 2(4.625,-2)
CRYSTAL-SMD_4P-L3.2-W2.5-BL-1
  rect 1.4x1.2 smd: 1(-1.1,-0.875) 2(1.1,-0.875) 3(1.1,0.875) 4(-1.1,0.875)
FPC-SMD_9P-P0.50_JS_AFD01-S09FCA-00
  rect 0.3x1.25 smd: 1(-2,-1.363) 2(-1.5,-1.363) 3(-1,-1.363) 4(-0.5,-1.363) 5(0,-1.363) 6(0.499,-1.363) 7(1,-1.363) 8(1.5,-1.363) 9(2,-1.363)
  rect 2.3x2.2 smd: 10(3.9,1.363) 11(-3.9,1.363)
FPC-SMD_AFC01-S14FCA-00
  rect 0.3x1.3 smd: 1(-3.25,1.34) 2(-2.75,1.339) 3(-2.25,1.34) 4(-1.75,1.34) 5(-1.25,1.34) 6(-0.75,1.34) 7(-0.25,1.34) 8(0.25,1.34) 9(0.75,1.34) 10(1.25,1.34) 11(1.75,1.34) 12(2.25,1.34) 13(2.75,1.34) 14(3.25,1.34)
  rect 2x1.6 smd: 15(4.948,-1.34) 16(-4.948,-1.34)
HDR-TH_4P-P2.54-V-M
  rect 1.7x1.7 hole 1.1: 1(-3.81,0)
  round 1.7 hole 1.1: 2(-1.27,0) 3(1.27,0) 4(3.81,0)
IND-SMD_L1.2-W0.7
  rect 0.36x0.66 smd: 1(-0.41,0) 2(0.41,0)
KEY-SMD_1TS003B
  rect 0.9x0.8 smd: 1(1.7,1) 2(-1.7,1)
  rect 0.6x1.2 smd: 3(-2.3,-1) 4(2.3,-1)
LQFP-48_L7.0-W7.0-P0.50-LS9.0-BL
  oval 0.27x1.5 smd: 1(-2.75,-4.25) 2(-2.25,-4.25) 3(-1.75,-4.25) 4(-1.25,-4.25) 5(-0.75,-4.25) 6(-0.25,-4.25) 7(0.25,-4.25) 8(0.75,-4.25) 9(1.25,-4.25) 10(1.75,-4.25) 11(2.25,-4.25) 12(2.75,-4.25) 25(2.75,4.25) 26(2.25,4.25) 27(1.75,4.25) 28(1.25,4.25) 29(0.75,4.25) 30(0.25,4.25) 31(-0.25,4.25) 32(-0.75,4.25) 33(-1.25,4.25) 34(-1.75,4.25) 35(-2.25,4.25) 36(-2.75,4.25)
  oval 1.5x0.27 smd: 13(4.25,-2.75) 14(4.25,-2.25) 15(4.25,-1.75) 16(4.25,-1.25) 17(4.25,-0.75) 18(4.25,-0.25) 19(4.25,0.25) 20(4.25,0.75) 21(4.25,1.25) 22(4.25,1.75) 23(4.25,2.25) 24(4.25,2.75) 37(-4.25,2.75) 38(-4.25,2.25) 39(-4.25,1.75) 40(-4.25,1.25) 41(-4.25,0.75) 42(-4.25,0.25) 43(-4.25,-0.25) 44(-4.25,-0.75) 45(-4.25,-1.25) 46(-4.25,-1.75) 47(-4.25,-2.25) 48(-4.25,-2.75)
LQFP-100_L14.0-W14.0-P0.50-LS16.0-BL
  oval 0.3x1.6 smd: 1(-6,-7.55) 2(-5.5,-7.55) 3(-5,-7.55) 4(-4.5,-7.55) 5(-4,-7.55) 6(-3.5,-7.55) 7(-3,-7.55) 8(-2.5,-7.55) 9(-2,-7.55) 10(-1.5,-7.55) 11(-1,-7.55) 12(-0.5,-7.55) 13(0,-7.55) 14(0.5,-7.55) 15(1,-7.55) 16(1.5,-7.55) 17(2,-7.55) 18(2.5,-7.55) 19(3,-7.55) 20(3.5,-7.55) 21(4,-7.55) 22(4.5,-7.55) 23(5,-7.55) 24(5.5,-7.55) 25(6,-7.55) 51(6,7.55) 52(5.5,7.55) 53(5,7.55) 54(4.5,7.55) 55(4,7.55) 56(3.5,7.55) 57(3,7.55) 58(2.5,7.55) 59(2,7.55) 60(1.5,7.55) 61(1,7.55) 62(0.5,7.55) 63(0,7.55) 64(-0.5,7.55) 65(-1,7.55) 66(-1.5,7.55) 67(-2,7.55) 68(-2.5,7.55) 69(-3,7.55) 70(-3.5,7.55) 71(-4,7.55) 72(-4.5,7.55) 73(-5,7.55) 74(-5.5,7.55) 75(-6,7.55)
  oval 1.6x0.3 smd: 26(7.55,-6) 27(7.55,-5.5) 28(7.55,-5) 29(7.55,-4.5) 30(7.55,-4) 31(7.55,-3.5) 32(7.55,-3) 33(7.55,-2.5) 34(7.55,-2) 35(7.55,-1.5) 36(7.55,-1) 37(7.55,-0.5) 38(7.55,0) 39(7.55,0.5) 40(7.55,1) 41(7.55,1.5) 42(7.55,2) 43(7.55,2.5) 44(7.55,3) 45(7.55,3.5) 46(7.55,4) 47(7.55,4.5) 48(7.55,5) 49(7.55,5.5) 50(7.55,6) 76(-7.55,6) 77(-7.55,5.5) 78(-7.55,5) 79(-7.55,4.5) 80(-7.55,4) 81(-7.55,3.5) 82(-7.55,3) 83(-7.55,2.5) 84(-7.55,2) 85(-7.55,1.5) 86(-7.55,1) 87(-7.55,0.5) 88(-7.55,0) 89(-7.55,-0.5) 90(-7.55,-1) 91(-7.55,-1.5) 92(-7.55,-2) 93(-7.55,-2.5) 94(-7.55,-3) 95(-7.55,-3.5) 96(-7.55,-4) 97(-7.55,-4.5) 98(-7.55,-5) 99(-7.55,-5.5) 100(-7.55,-6)
OPTO-SMD_QRE1113GR
  rect 1.66x0.8 smd: 1(-2,-0.9) 2(2,-0.9) 3(2,0.9) 4(-2,0.9)
R0402
  rect 0.566x0.54 smd: 1(-0.433,0) 2(0.433,0)
R0603
  rect 0.806x0.864 smd: 1(-0.753,0) 2(0.753,0)
RES-TH_BD1.8-L3.2-P7.20-D0.4
  round 1.2 hole 0.8: 1(-3.6,0) 2(3.6,0)
Screw-Hole-M2
  round 2 hole 2: 1(0,0)
Screw-Hole-M3
  round 3.2 hole 3.2: 1(-0.064,0.064)
SOD-323_L1.7-W1.3-LS2.5-RD
  rect 0.8x0.8 smd: 1(-1.2,0) 2(1.2,0)
SOD-323_L1.8-W1.3-LS2.5-BI
  rect 0.985x0.49 smd: 1(-1.117,0) 2(1.117,0)
SOD-323_L1.8-W1.3-LS2.5-RD
  rect 1x0.75 smd: 1(-1.173,0) 2(1.173,0)
SOT-23-5_L3.0-W1.7-P0.95-LS2.8-BR
  rect 1.1x0.6 smd: 1(1.3,-0.95) 2(1.3,0) 3(1.3,0.95) 4(-1.3,0.95) 5(-1.3,-0.95)
Test-Point-0.5mm
  round 0.5 smd: 1(0,0)
TSOT-23-5_L2.9-W1.6-P0.95-LS2.8-BR
  rect 1.1x0.7 smd: 1(1.294,-0.951) 2(1.294,-0.001) 3(1.294,0.951) 4(-1.294,0.951) 5(-1.294,-0.949)
USB-3.1-SMD_U262-161N-4BVC11
  oval 1.2x2.2 hole 0.7x1.8: 13(4.32,1.719) 16(-4.32,1.719)
  oval 1.2x1.8 hole 0.7x1.3: 14(4.32,-2.462) 15(-4.32,-2.462)
  rect 0.6x1.3 smd: A1B12(-3.2,2.462) A4B9(-2.4,2.462) B1A12(3.2,2.462) B4A9(2.4,2.462)
  rect 0.3x1.3 smd: A5(-1.25,2.462) A6(-0.25,2.462) A7(0.25,2.462) A8(1.25,2.462) B5(1.75,2.462) B6(0.75,2.462) B7(-0.75,2.462) B8(-1.75,2.462)

## Nets
+3V3: C50.2 C55.2 C64.1 C65.1 C66.1 C67.1 C68.1 C69.1 H5.1 L1.2 R85.2 R101.1 R102.1 R104.1 R113.1 SW1.1 U39.6 U39.11 U39.27 U39.50 U39.75 U39.100
+5V: C51.1 C56.2 D10.1 D11.1 H6.4 R87.2 U37.1 U37.4 U38.1 X4.1
